# EAGLE design linefollower L293D (EAGLE 9.4.0)
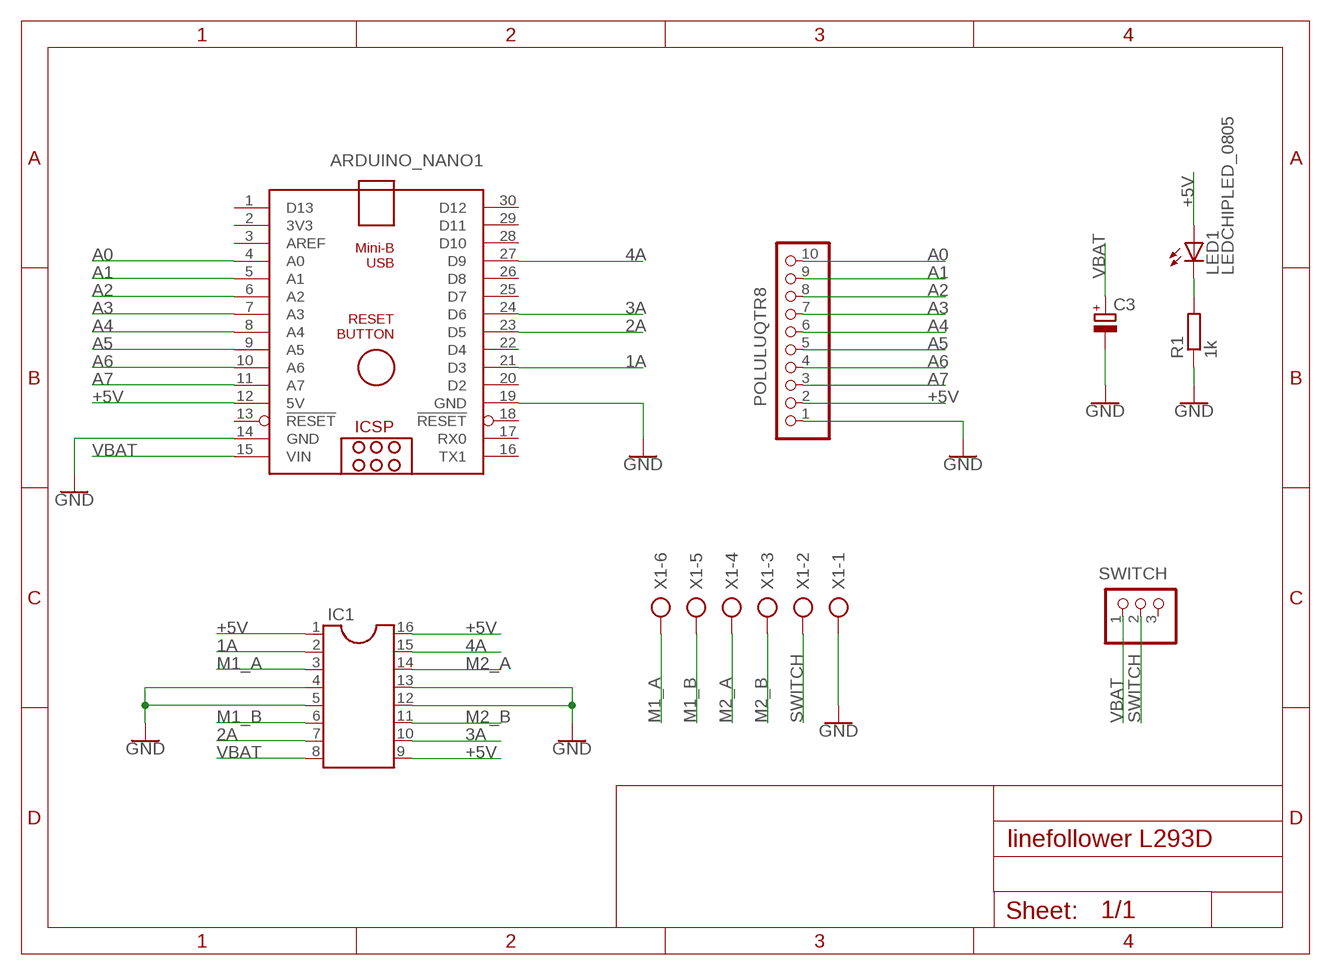
[diagram p0: schematic, sheet 1]

## Parts
ARDUINO_NANO1  ARDUINO_NANO  [ARDUINO_NANO]
C3  UCD1V221MNL1GS  [CAPAE830X1050]
IC1  DIL16  [DIL16]
LED1  LEDCHIPLED_0805  [CHIPLED_0805]
POLULUQTR8  PINHD-1X10  [1X10]
R1  1k  R-EU_R0805  [R0805]
SWITCH  PINHD-1X3  [1X03]
X1  AK500/6  [AK500/6]

## Nets
1A: ARDUINO_NANO1.21(D3) IC1.2
2A: ARDUINO_NANO1.23(D5) IC1.7
3A: ARDUINO_NANO1.24(D6) IC1.10
4A: ARDUINO_NANO1.27(D9) IC1.15
+5V: ARDUINO_NANO1.12(5V) IC1.1 IC1.9 IC1.16 LED1.A POLULUQTR8.2
A0: ARDUINO_NANO1.4(A0) POLULUQTR8.10
A1: ARDUINO_NANO1.5(A1) POLULUQTR8.9
A2: ARDUINO_NANO1.6(A2) POLULUQTR8.8
A3: ARDUINO_NANO1.7(A3) POLULUQTR8.7
A4: ARDUINO_NANO1.8(A4) POLULUQTR8.6
A5: ARDUINO_NANO1.9(A5) POLULUQTR8.5
A6: ARDUINO_NANO1.10(A6) POLULUQTR8.4
A7: ARDUINO_NANO1.11(A7) POLULUQTR8.3
GND: ARDUINO_NANO1.14(GND) ARDUINO_NANO1.19(GND) C3.2(-) IC1.4 IC1.5 IC1.12 IC1.13 POLULUQTR8.1 R1.1 X1.1
M1_A: IC1.3 X1.6
M1_B: IC1.6 X1.5
M2_A: IC1.14 X1.4
M2_B: IC1.11 X1.3
N$1: LED1.C R1.2
SWITCH: SWITCH.2 X1.2
VBAT: ARDUINO_NANO1.15(VIN) C3.1(+) IC1.8 SWITCH.1
Unconnected: ARDUINO_NANO1.1(D13) ARDUINO_NANO1.2(3V3) ARDUINO_NANO1.3(AREF) ARDUINO_NANO1.13(!RESET) ARDUINO_NANO1.16(TX1) ARDUINO_NANO1.17(RX0) ARDUINO_NANO1.18(!RESET) ARDUINO_NANO1.20(D2) ARDUINO_NANO1.22(D4) ARDUINO_NANO1.25(D7) ARDUINO_NANO1.26(D8) ARDUINO_NANO1.28(D10) ARDUINO_NANO1.29(D11) ARDUINO_NANO1.30(D12) SWITCH.3

## Library data of the parts
ARDUINO_NANO1 = ArduinoNanoV30:ARDUINO_NANO: Arduino Nano V3.0 Overview: The Arduino Nano is a small, complete, and breadboard-friendly board based on the ATmega328 (Arduino Nano 3.x) or ATmega168 (Arduino Nano 2.x). It has more or less the same functionality of the Arduino Duemilanove, but in a different package. It lacks only a DC power jack, and works with a Mini-B USB cable instead of a standard one. The Nano was designed and is being produced by Gravitech. Specifications: Microcontroller Atmel ATmega168 or ATmega328 Operating Voltage (logic level) 5 V Input Voltage (recommended) 7-12 V Input Voltage (limits) 6-20 V Digital I/O Pins 14 (of which 6 provide PWM output) Analog Input Pins 8 DC Current per I/O Pin 40 mA Flash Memory 16 KB (ATmega168) or 32 KB (ATmega328) of which 2 KB used by bootloader SRAM 1 KB (ATmega168) or 2 KB (ATmega328) EEPROM 512 bytes (ATmega168) or 1 KB (ATmega328) Clock Speed 16 MHz Dimensions 0.73" x 1.70" Length 45 mm Width 18 mm Weigth 5 g Power: The Arduino Nano can be powered via the Mini-B USB connection, 6-20V unregulated external power supply (pin 30), or 5V regulated external power supply (pin 27). The power source is automatically selected to the highest voltage source. Memory: The ATmega168 has 16 KB of flash memory for storing code (of which 2 KB is used for the bootloader); the ATmega328 has 32 KB, (also with 2 KB used for the bootloader). The ATmega168 has 1 KB of SRAM and 512 bytes of EEPROM (which can be read and written with the EEPROM library); the ATmega328 has 2 KB of SRAM and 1 KB of EEPROM. Input and Output: Each of the 14 digital pins on the Nano can be used as an input or output, using pinMode(), digitalWrite(), and digitalRead() functions. They operate at 5 volts. Each pin can provide or receive a maximum of 40 mA and has an internal pull-up resistor (disconnected by default) of 20-50 kOhms. In addition, some pins have specialized functions. Visit Arduino - ArduinoBoardNano <https://www.arduino.cc/en/Main/ArduinoBoardNano>
C3 = rosbotlib:UCD1V221MNL1GS
IC1 = ic-package:DIL16: Dual In Line / Socket
LED1 = audio amplifier example:LED
POLULUQTR8 = pinhead:PINHD-1X10: PIN HEADER
R1 = rcl:R-EU_: RESISTOR, European symbol; SPICEPREFIX: R
SWITCH = pinhead:PINHD-1X3: PIN HEADER
X1 = con-ptr500:AK500/6: CONNECTOR; OC_FARNELL: unknown; OC_NEWARK: unknown

## Board
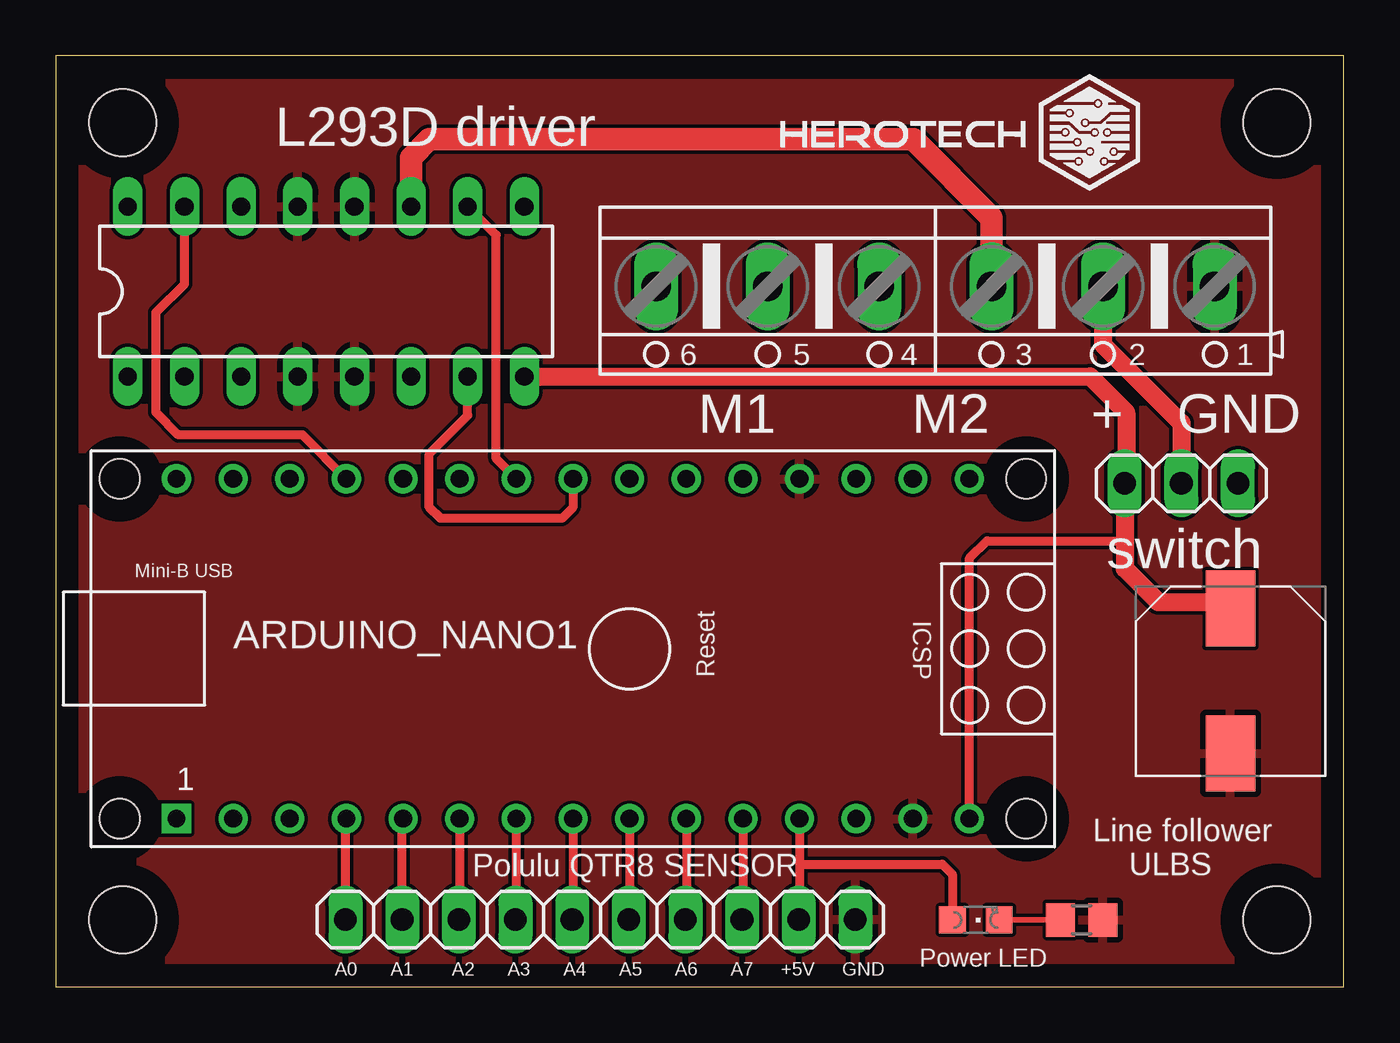
[diagram p1: board, top side]
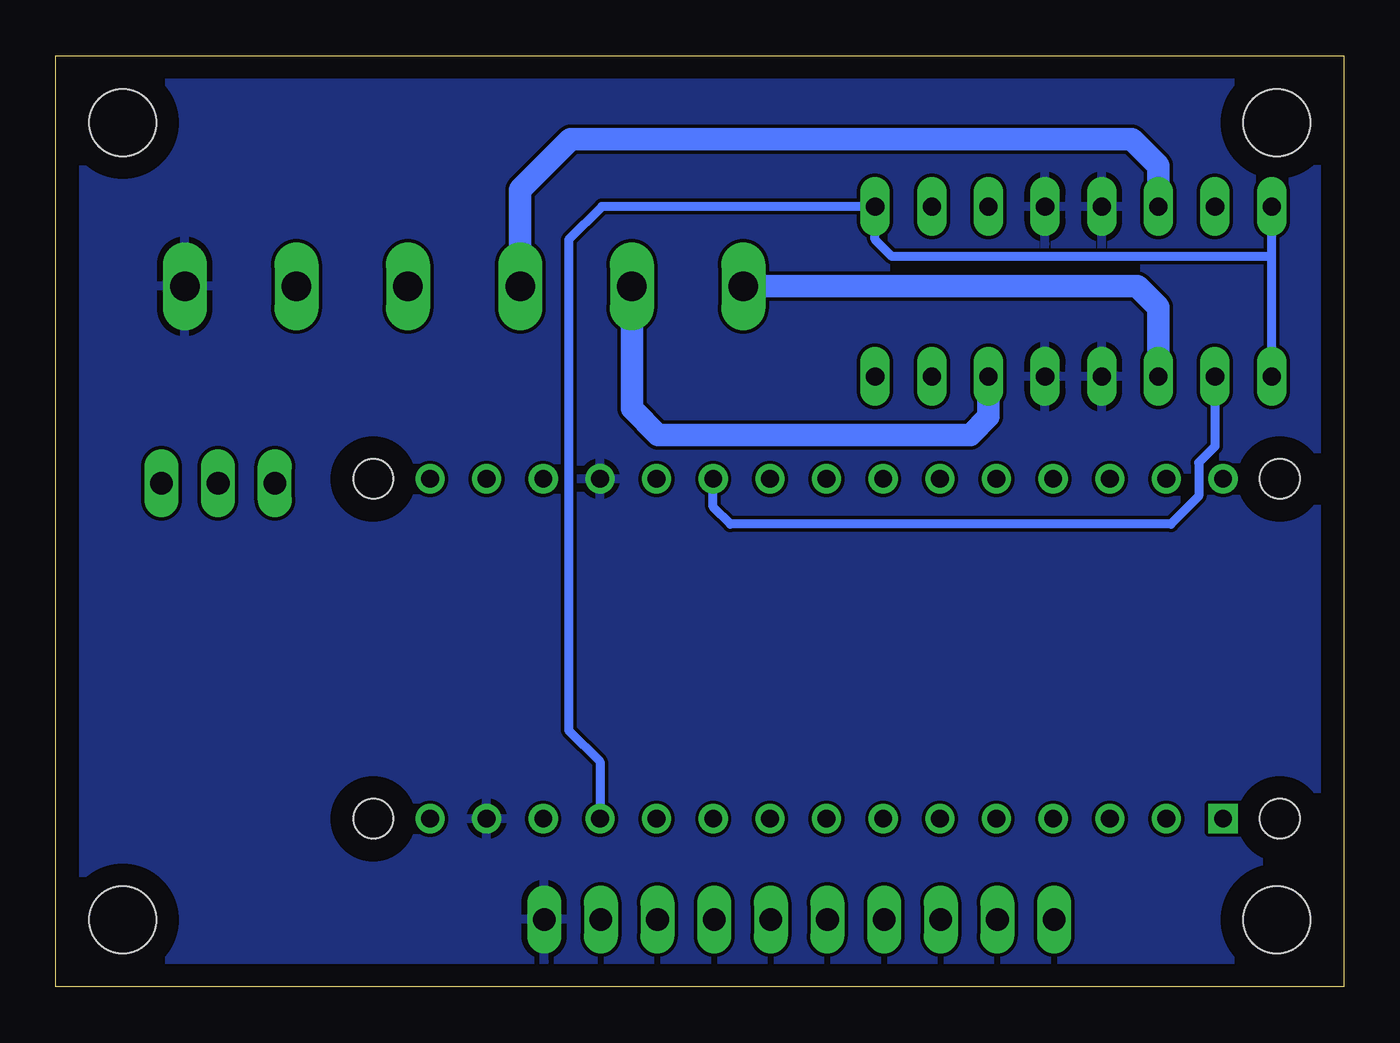
[diagram p2: board, bottom side, seen from below]

Size 57.75 x 41.76 mm. Coordinates in mm from the lower left corner, seen from the top.
Outline: 0,0 57.75,0.01 57.75,41.76 0,41.76 0,0
Copper layers (1*16): Top 0.035mm / dielectric 1.5mm / Bottom 0.035mm
Design rules "default": minimum track width 6mil, minimum drill 0.35mm, track to track 6mil, track to pad 6mil, pad to pad 6mil, via to via 6mil, smd to smd 6mil, copper to edge 40mil, drill to drill 6mil, minimum pad ring 10mil, minimum via ring 8mil, stop-mask expansion 4mil, vias tented up to drill 0mil, thermal gap 10mil
Holes 3 mm at 3,38.76 54.75,38.76 3,3.01 54.75,3.01

### Footprints (pad centres in the part's own frame; a part is rotated, then mirrored left to right if it is on the bottom)
ARDUINO_NANO = drill 0.8 square: 1 -20.32,-7.62 | drill 0.8: 2 -17.78,-7.62; 3 -15.24,-7.62; 4 -12.7,-7.62; 5 -10.16,-7.62; 6 -7.62,-7.62; 7 -5.08,-7.62; 8 -2.54,-7.62; 9 0,-7.62; 10 2.54,-7.62; 11 5.08,-7.62; 12 7.62,-7.62; 13 10.16,-7.62; 14 12.7,-7.62; 15 15.24,-7.62; 16 15.24,7.62; 17 12.7,7.62; 18 10.16,7.62; 19 7.62,7.62; 20 5.08,7.62; 21 2.54,7.62; 22 0,7.62; 23 -2.54,7.62; 24 -5.08,7.62; 25 -7.62,7.62; 26 -10.16,7.62; 27 -12.7,7.62; 28 -15.24,7.62; 29 -17.78,7.62; 30 -20.32,7.62 | hole 1.778: -22.86,-7.62; -22.86,7.62; 17.78,7.62; 17.78,-7.62
CAPAE830X1050 = smd 3.414 x 2.212: 1 -3.251,0; 2 3.251,0
DIL16 = drill 0.813 long: 1 -8.89,-3.81; 2 -6.35,-3.81; 3 -3.81,-3.81; 4 -1.27,-3.81; 5 1.27,-3.81; 6 3.81,-3.81; 7 6.35,-3.81; 8 8.89,-3.81; 9 8.89,3.81; 10 6.35,3.81; 11 3.81,3.81; 12 1.27,3.81; 13 -1.27,3.81; 14 -3.81,3.81; 15 -6.35,3.81; 16 -8.89,3.81
CHIPLED_0805 = smd 1.2 x 1.2: A 0,-1.05; C 0,1.05
1X10 = drill 1.016 long: 1 -11.43,0; 2 -8.89,0; 3 -6.35,0; 4 -3.81,0; 5 -1.27,0; 6 1.27,0; 7 3.81,0; 8 6.35,0; 9 8.89,0; 10 11.43,0
R0805 = smd 1.3 x 1.5: 1 -0.95,0; 2 0.95,0
1X03 = drill 1.016 long: 1 -2.54,0; 2 0,0; 3 2.54,0
AK500/6 = drill 1.321 long: 1 -12.522,0; 2 -7.518,0; 3 -2.515,0; 4 2.515,0; 5 7.518,0; 6 12.522,0

### Placement (x,y rotation side)
ARDUINO_NANO1  25.73,15.17 0 top
C3  52.67,13.72 270 top
IC1  12.12,31.19 0 top
LED1  41.25,3.01 270 top
POLULUQTR8  24.42,3.03 180 top
R1  46,3.01 180 top
SWITCH  50.47,22.59 0 top
X1  39.44,31.42 180 top

### Tracks (layer width: path | path; a pad name or v marks a point on that pad's centre or on a via)
1A
  Bottom 0.406: ARDUINO_NANO1.21 28.27,21.53 27.5,20.76 7.75,20.76 6.5,22.01 6.5,23.51 5.77,24.24 IC1.2
2A
  Top 0.406: ARDUINO_NANO1.23 23.19,21.51 22.69,21.01 17.25,21.01 16.75,21.51 16.75,23.91 18.47,25.63 IC1.7
3A
  Top 0.406: ARDUINO_NANO1.24 19.75,23.69 19.75,33.72 IC1.10
4A
  Top 0.406: ARDUINO_NANO1.27 11.06,24.76 5.5,24.76 4.5,25.76 4.5,30.26 5.77,31.53 IC1.15
+5V
  Top 0.254: 33.35,3.07 POLULUQTR8.2
  Top 0.406: ARDUINO_NANO1.12 33.35,5.51 | 33.35,5.51 33.35,3.07 | LED1.A 40.2,5.06 39.75,5.51 33.35,5.51
  Bottom 0.406: IC1.1 3.23,32.76 | 3.23,32.76 IC1.16 | 3.23,32.76 20.25,32.76 21.01,33.52 IC1.9 33.26,35 34.75,33.51 34.75,11.51 33.35,10.11 ARDUINO_NANO1.12
A0
  Top 0.254: 12.99,7.51 ARDUINO_NANO1.4
  Top 0.406: POLULUQTR8.10 12.99,7.51
A1
  Top 0.254: 15.53,7.51 ARDUINO_NANO1.5
  Top 0.406: POLULUQTR8.9 15.53,7.51
A2
  Top 0.254: 18.11,3.07 POLULUQTR8.8
  Top 0.406: ARDUINO_NANO1.6 18.11,3.07
A3
  Top 0.254: 20.65,3.07 POLULUQTR8.7
  Top 0.406: ARDUINO_NANO1.7 20.65,3.07
A4
  Top 0.254: 23.19,3.07 POLULUQTR8.6
  Top 0.406: ARDUINO_NANO1.8 23.19,3.07
A5
  Top 0.254: 25.73,3.07 POLULUQTR8.5
  Top 0.406: ARDUINO_NANO1.9 25.73,3.07
A6
  Top 0.254: 28.27,3.07 POLULUQTR8.4
  Top 0.406: ARDUINO_NANO1.10 28.27,3.07
A7
  Top 0.254: 30.81,3.07 POLULUQTR8.3
  Top 0.406: ARDUINO_NANO1.11 30.81,3.07
GND
  pour Top: 0.5,41.01 56.75,41.01 56.75,0.51 0.5,0.51
  pour Bottom: 0.5,41.26 57,41.26 57,0.51 0.5,0.51
M1_A
  Bottom 1.016: X1.6 9.25,31.42 8.31,30.48 IC1.3
M1_B
  Bottom 1.016: IC1.6 15.93,25.58 16.75,24.76 30.75,24.76 31.92,25.93 X1.5
M2_A
  Bottom 1.016: X1.4 36.93,35.76 34.68,38.01 9.5,38.01 8.31,36.82 IC1.14
M2_B
  Top 1.016: X1.3 41.95,34.51 38.45,38.01 16.75,38.01 15.93,37.19 IC1.11
N$1
  Top 0.254: R1.2 LED1.C
SWITCH
  Top 0.813: SWITCH.2 50.47,25.29 46.96,28.8 X1.2
VBAT
  Top 0.406: ARDUINO_NANO1.15 40.97,19.23 41.75,20.01 47.93,20.01
  Top 0.813: IC1.8 46.38,27.38 48,25.76 48,22.66 SWITCH.1 47.93,20.01 47.93,18.76 49.43,17.26 53,17.26 52.71,16.97 C3.1

### Text on the board
tPlace: L293D driver | M1 | M2 | + | GND | switch | Polulu QTR8 SENSOR | Line follower / ULBS | Power LED | A0 | A1 | A2 | A3 | A4 | A5 | A6 | A7 | +5V | GND